# EAGLE design archadehid_revA (EAGLE 6.5.0)

## Sheet 1 of 2
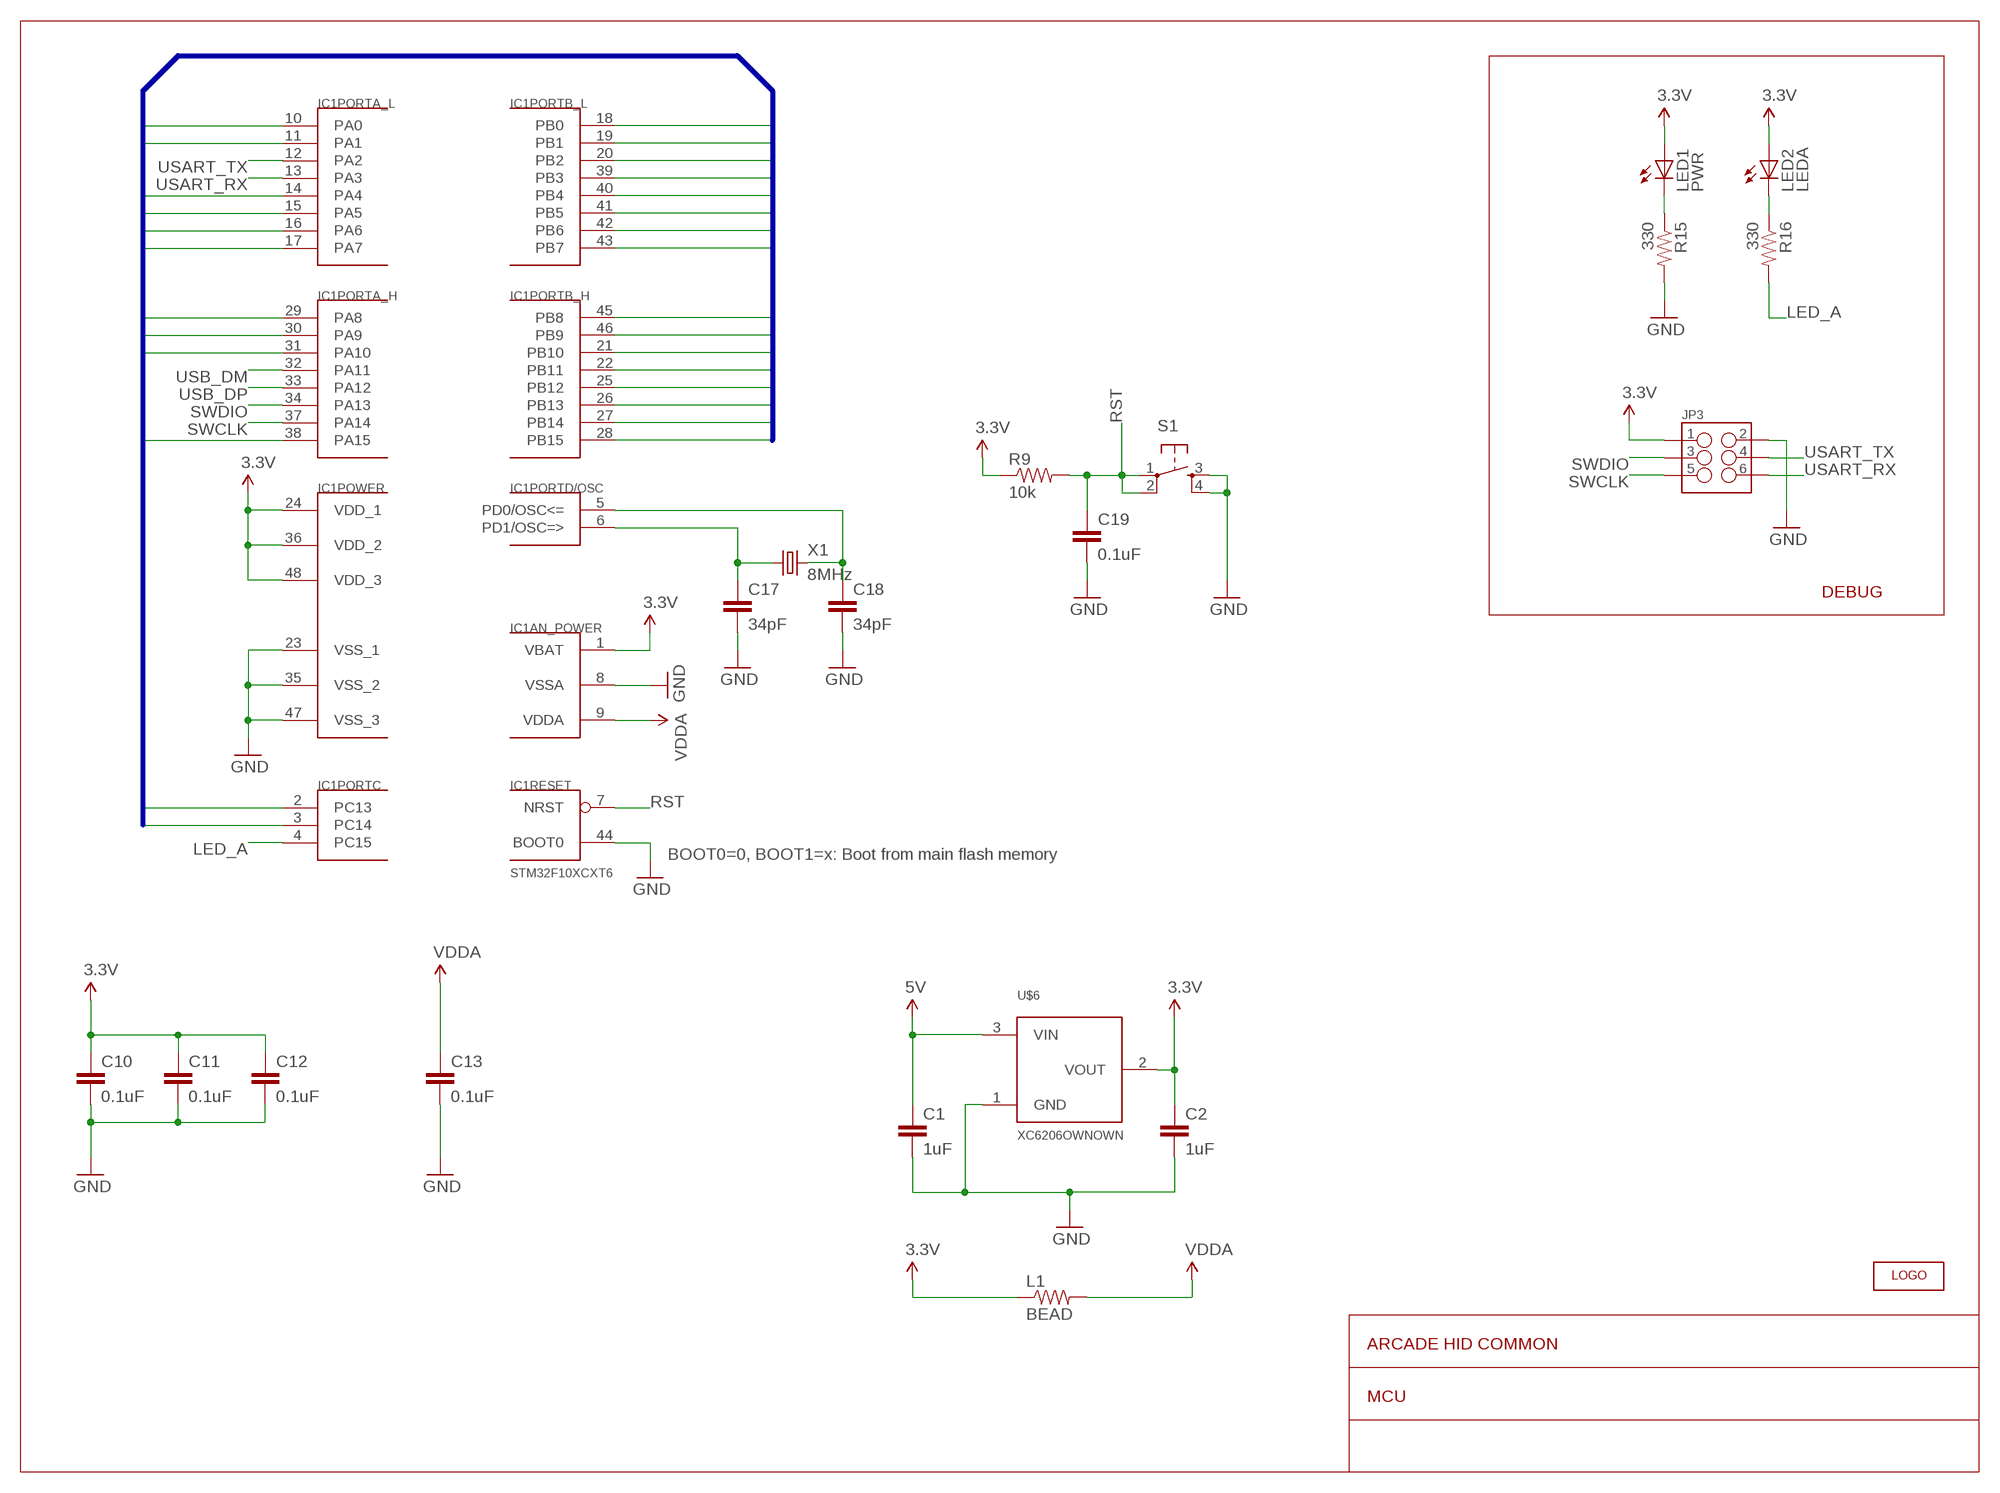
[diagram p0: schematic, sheet 1]

### Parts
C1  1uF  CAP0805  [0805_GEN]
C2  1uF  CAP0805  [0805_GEN]
C10  0.1uF  CAP0402  [C0402]
C11  0.1uF  CAP0402  [C0402]
C12  0.1uF  CAP0402  [C0402]
C13  0.1uF  CAP0402  [C0402]
C17  34pF  CAP0402  [C0402]
C18  34pF  CAP0402  [C0402]
C19  0.1uF  CAP0402  [C0402]
IC1  STM32F10XCXT6  [TQFP48]
JP3  M03X2NO_SILK  [2X3-NS]
L1  BEAD  RESISTOR0603  [0603_GEN]
LED1  PWR  LED0603  [LED-0603]
LED2  LEDA  LED0603  [LED-0603]
R9  10k  RESISTOR0402  [C0402]
R15  330  RESISTOR0402  [C0402]
R16  330  RESISTOR0402  [C0402]
S1  TAC_SWITCHSMD  [TACTILE_SWITCH_SMD]
U$6  XC6206OWNOWN  [SOT23]
U$7  LOGOLOGO  [LOGO]
X1  8MHz  CRYSTALOWN5X3.2_7A  [CRYSTAL_SMD_5X3.2_7A]

### Nets
3.3V: C2.1 C10.1 C11.1 C12.1 IC1.1(AN_POWER:VBAT) IC1.24(POWER:VDD_1) IC1.36(POWER:VDD_2) IC1.48(POWER:VDD_3) JP3.1 L1.1 LED1.A LED2.A R9.1 U$6.2(VOUT) ; also sheet 2
5V: C1.1 U$6.3(VIN) ; also sheet 2
GND: C1.2 C2.2 C10.2 C11.2 C12.2 C13.2 C17.2 C18.2 C19.2 IC1.8(AN_POWER:VSSA) IC1.23(POWER:VSS_1) IC1.35(POWER:VSS_2) IC1.44(RESET:BOOT0) IC1.47(POWER:VSS_3) JP3.2 R15.2 S1.3 S1.4 U$6.1(GND) ; also sheet 2
LED_A: IC1.4(PORTC:PC15) R16.2
N$4: LED1.C R15.1
N$5: LED2.C R16.1
OSCI: C18.1 IC1.5(PORTD/OSC:PD0/OSC<=) X1.P$2
OSCO: C17.1 IC1.6(PORTD/OSC:PD1/OSC=>) X1.P$1
PA0: IC1.10(PORTA_L:PA0) ; also sheet 2
PA1: IC1.11(PORTA_L:PA1) ; also sheet 2
PA4: IC1.14(PORTA_L:PA4) ; also sheet 2
PA5: IC1.15(PORTA_L:PA5) ; also sheet 2
PA6: IC1.16(PORTA_L:PA6) ; also sheet 2
PA7: IC1.17(PORTA_L:PA7) ; also sheet 2
PA8: IC1.29(PORTA_H:PA8) ; also sheet 2
PA9: IC1.30(PORTA_H:PA9) ; also sheet 2
PA10: IC1.31(PORTA_H:PA10) ; also sheet 2
PA15: IC1.38(PORTA_H:PA15) ; also sheet 2
PB0: IC1.18(PORTB_L:PB0) ; also sheet 2
PB1: IC1.19(PORTB_L:PB1) ; also sheet 2
PB2: IC1.20(PORTB_L:PB2) ; also sheet 2
PB3: IC1.39(PORTB_L:PB3) ; also sheet 2
PB4: IC1.40(PORTB_L:PB4) ; also sheet 2
PB5: IC1.41(PORTB_L:PB5) ; also sheet 2
PB6: IC1.42(PORTB_L:PB6) ; also sheet 2
PB7: IC1.43(PORTB_L:PB7) ; also sheet 2
PB8: IC1.45(PORTB_H:PB8) ; also sheet 2
PB9: IC1.46(PORTB_H:PB9) ; also sheet 2
PB10: IC1.21(PORTB_H:PB10) ; also sheet 2
PB11: IC1.22(PORTB_H:PB11) ; also sheet 2
PB12: IC1.25(PORTB_H:PB12) ; also sheet 2
PB13: IC1.26(PORTB_H:PB13) ; also sheet 2
PB14: IC1.27(PORTB_H:PB14) ; also sheet 2
PB15: IC1.28(PORTB_H:PB15) ; also sheet 2
PC13: IC1.2(PORTC:PC13) ; also sheet 2
PC14: IC1.3(PORTC:PC14) ; also sheet 2
RST: C19.1 IC1.7(RESET:NRST) R9.2 S1.1 S1.2
SWCLK: IC1.37(PORTA_H:PA14) JP3.5
SWDIO: IC1.34(PORTA_H:PA13) JP3.3
USART_RX: IC1.13(PORTA_L:PA3) JP3.6
USART_TX: IC1.12(PORTA_L:PA2) JP3.4
USB_DM: IC1.32(PORTA_H:PA11) ; also sheet 2
USB_DP: IC1.33(PORTA_H:PA12) ; also sheet 2
VDDA: C13.1 IC1.9(AN_POWER:VDDA) L1.2

### Buses
PA[0..1],PA[4..10],PA15,PB[0..15],PC[13..14]

### Notes on the sheet
- DEBUG
- BOOT0=0, BOOT1=x: Boot from main flash memory
- ARCADE HID COMMON
- MCU

## Sheet 2 of 2
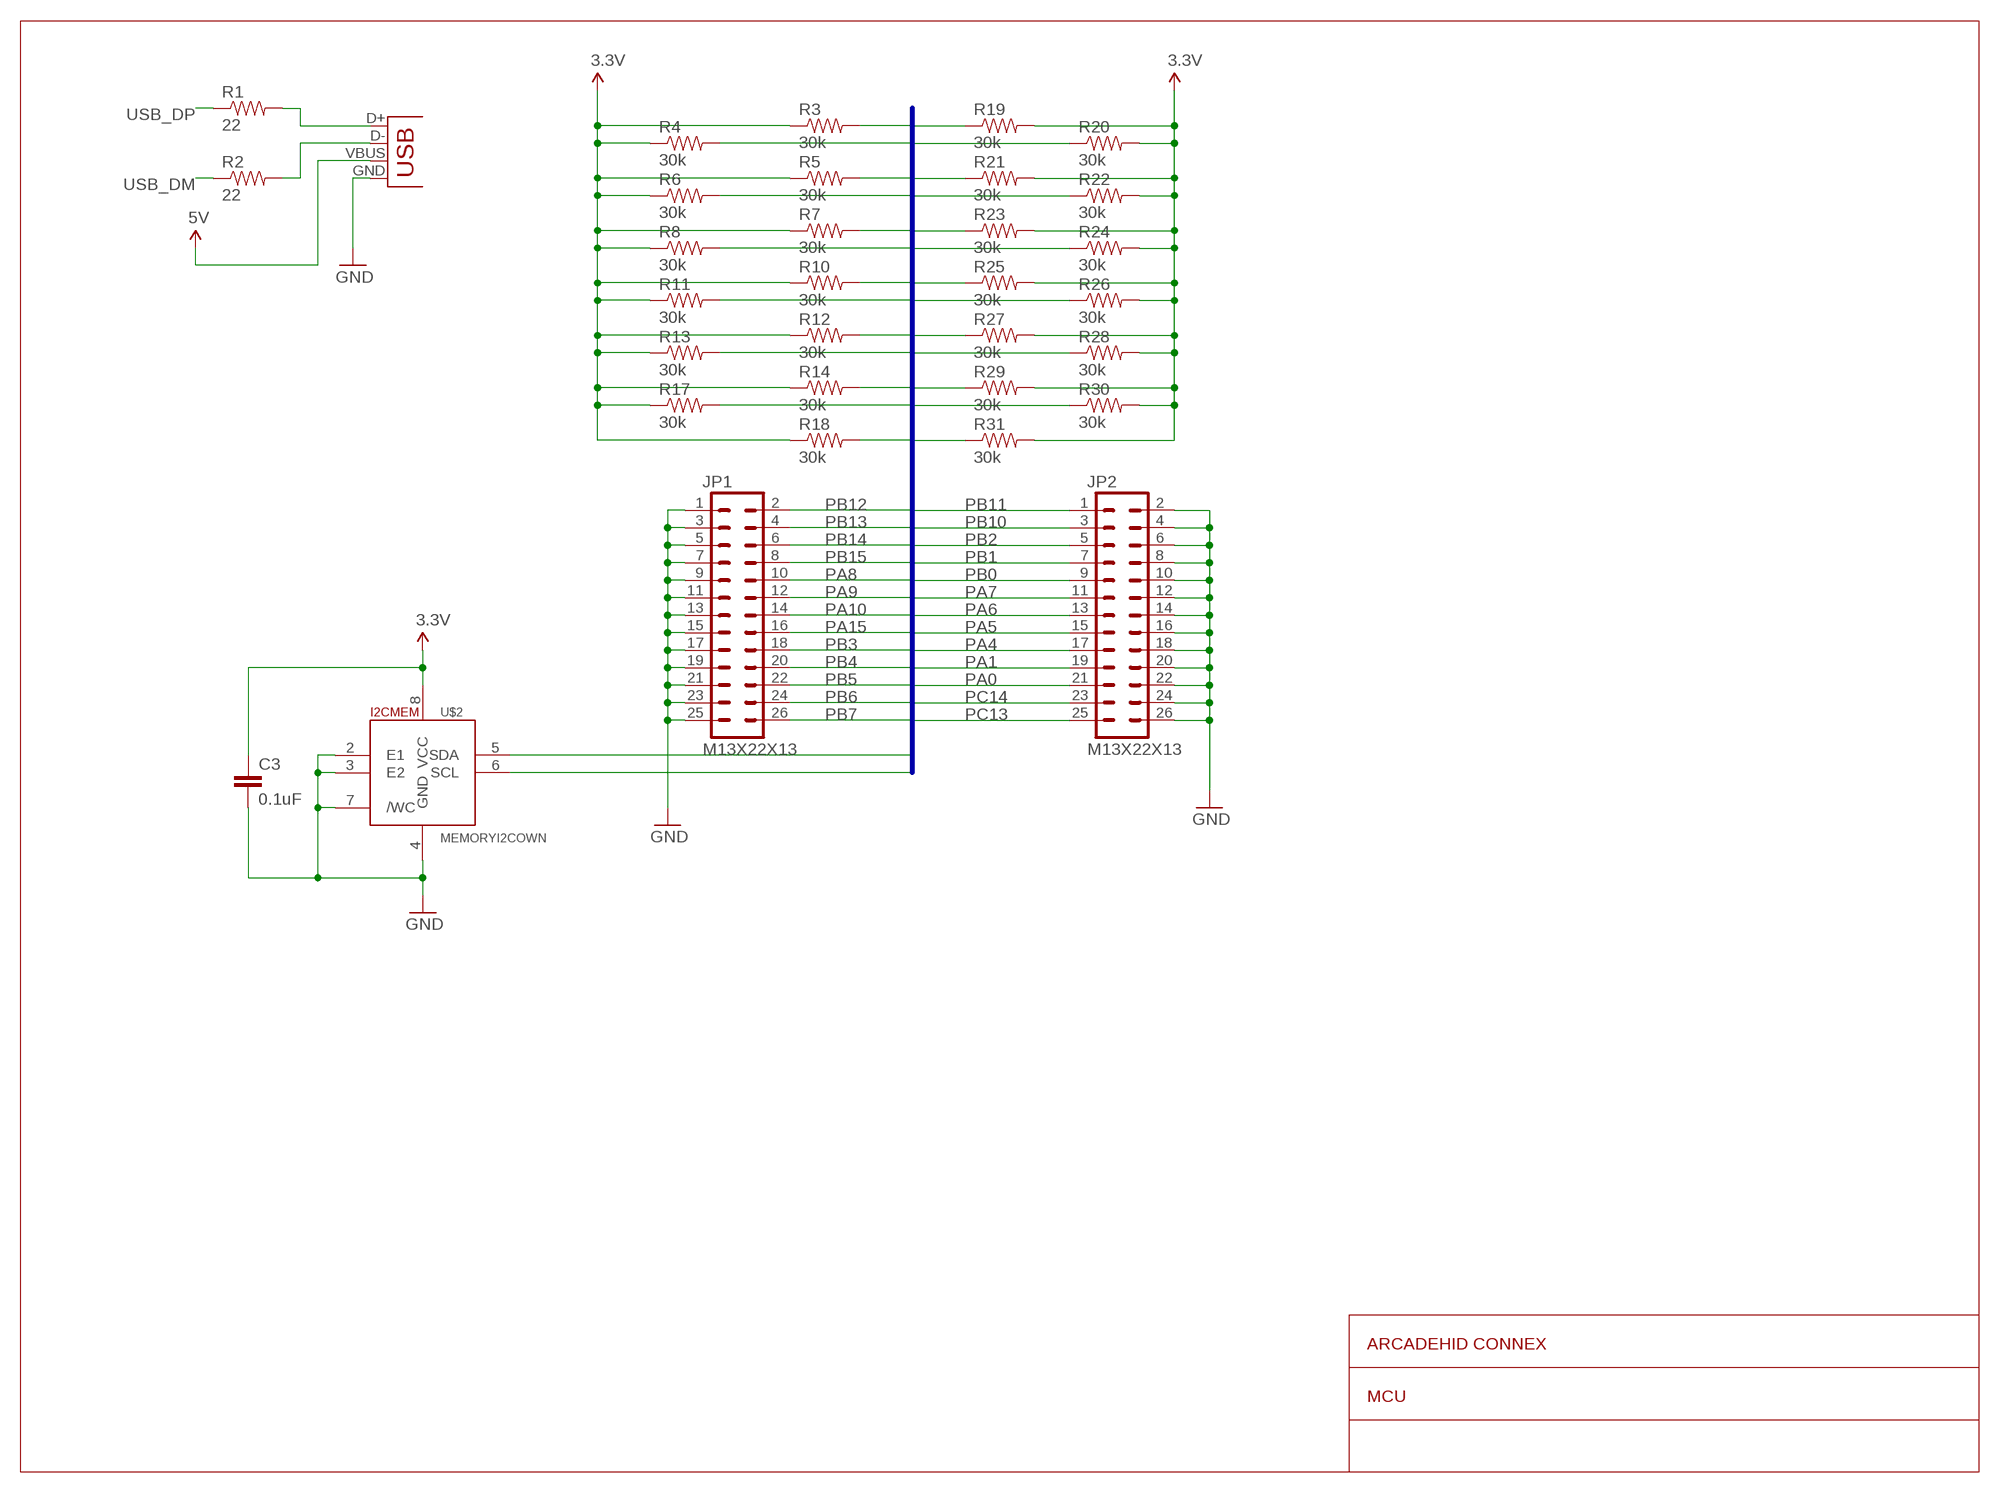
[diagram p1: schematic, sheet 2]

### Parts
C3  0.1uF  CAP0402  [C0402]
JP1  M13X22X13  [2X13]
JP2  M13X22X13  [2X13]
R1  22  RESISTOR0402  [C0402]
R2  22  RESISTOR0402  [C0402]
R3  30k  RESISTOR0402  [C0402]
R4  30k  RESISTOR0402  [C0402]
R5  30k  RESISTOR0402  [C0402]
R6  30k  RESISTOR0402  [C0402]
R7  30k  RESISTOR0402  [C0402]
R8  30k  RESISTOR0402  [C0402]
R10  30k  RESISTOR0402  [C0402]
R11  30k  RESISTOR0402  [C0402]
R12  30k  RESISTOR0402  [C0402]
R13  30k  RESISTOR0402  [C0402]
R14  30k  RESISTOR0402  [C0402]
R17  30k  RESISTOR0402  [C0402]
R18  30k  RESISTOR0402  [C0402]
R19  30k  RESISTOR0402  [C0402]
R20  30k  RESISTOR0402  [C0402]
R21  30k  RESISTOR0402  [C0402]
R22  30k  RESISTOR0402  [C0402]
R23  30k  RESISTOR0402  [C0402]
R24  30k  RESISTOR0402  [C0402]
R25  30k  RESISTOR0402  [C0402]
R26  30k  RESISTOR0402  [C0402]
R27  30k  RESISTOR0402  [C0402]
R28  30k  RESISTOR0402  [C0402]
R29  30k  RESISTOR0402  [C0402]
R30  30k  RESISTOR0402  [C0402]
R31  30k  RESISTOR0402  [C0402]
U$2  MEMORYI2COWN  [SO-8]
X3  USB-MINIB  [USB-MINIB]

### Nets
3.3V: C3.1 R3.1 R4.1 R5.1 R6.1 R7.1 R8.1 R10.1 R11.1 R12.1 R13.1 R14.1 R17.1 R18.1 R19.2 R20.2 R21.2 R22.2 R23.2 R24.2 R25.2 R26.2 R27.2 R28.2 R29.2 R30.2 R31.2 U$2.8(VCC) ; also sheet 1
5V: X3.VBUS ; also sheet 1
GND: C3.2 JP1.1 JP1.3 JP1.5 JP1.7 JP1.9 JP1.11 JP1.13 JP1.15 JP1.17 JP1.19 JP1.21 JP1.23 JP1.25 JP2.2 JP2.4 JP2.6 JP2.8 JP2.10 JP2.12 JP2.14 JP2.16 JP2.18 JP2.20 JP2.22 JP2.24 JP2.26 U$2.2(E1) U$2.3(E2) U$2.4(GND) U$2.7(/WC) X3.GND ; also sheet 1
N$1: R1.2 X3.D+
N$2: R2.2 X3.D-
PA0: JP2.21 R29.1 ; also sheet 1
PA1: JP2.19 R28.1 ; also sheet 1
PA4: JP2.17 R27.1 ; also sheet 1
PA5: JP2.15 R26.1 ; also sheet 1
PA6: JP2.13 R25.1 ; also sheet 1
PA7: JP2.11 R24.1 ; also sheet 1
PA8: JP1.10 R7.2 ; also sheet 1
PA9: JP1.12 R8.2 ; also sheet 1
PA10: JP1.14 R10.2 ; also sheet 1
PA15: JP1.16 R11.2 ; also sheet 1
PB0: JP2.9 R23.1 ; also sheet 1
PB1: JP2.7 R22.1 ; also sheet 1
PB2: JP2.5 R21.1 ; also sheet 1
PB3: JP1.18 R12.2 ; also sheet 1
PB4: JP1.20 R13.2 ; also sheet 1
PB5: JP1.22 R14.2 ; also sheet 1
PB6: JP1.24 R17.2 ; also sheet 1
PB7: JP1.26 R18.2 ; also sheet 1
PB8: U$2.6(SCL) ; also sheet 1
PB9: U$2.5(SDA) ; also sheet 1
PB10: JP2.3 R20.1 ; also sheet 1
PB11: JP2.1 R19.1 ; also sheet 1
PB12: JP1.2 R3.2 ; also sheet 1
PB13: JP1.4 R4.2 ; also sheet 1
PB14: JP1.6 R5.2 ; also sheet 1
PB15: JP1.8 R6.2 ; also sheet 1
PC13: JP2.25 R31.1 ; also sheet 1
PC14: JP2.23 R30.1 ; also sheet 1
USB_DM: R2.1 ; also sheet 1
USB_DP: R1.1 ; also sheet 1

### Buses
PA[0..1],PA[4..10],PA15,PB[0..15],PC[13..14]

### Notes on the sheet
- ARCADEHID CONNEX
- MCU

## Library data of the parts
C1-C3 C10-C13 C17-C19 = robot:CAP: Capacitor Standard 0603 ceramic capacitor, and 0.1" leaded capacitor.
IC1 = stm32:STM32F10XCXT6: ST STM32F101/103 48pin LQFP
JP1 JP2 = SparkFun-Connectors:M13X2: 0.1" spaced headers
JP3 = SparkFun-Connectors:M03X2: 2x3 .1" header. Shrouded, with keying- CONN-10681 SMT- CONN-11415 Pogo pins- HW-11044
L1 = robot:RESISTOR: Resistor Basic schematic elements and footprints for 0603, 1206, and PTH 1/10th watt (small) resistors.
LED1 LED2 = SparkFunEagle-6-6-07:LED: LEDs Standard schematic elements and footprints for 5mm, 3mm, 1206, and 0603 sized LEDs. 5mm - Spark Fun Electronics SKU : COM-00529 (and others)
R1-R31 = SparkFunEagle-6-6-07:RESISTOR: Resistor Basic schematic elements and footprints for 0603, 1206, and PTH 1/10th watt (small) resistors.
S1 = SparkFun-Electromechanical:TAC_SWITCH: Momentary Switch Button commonly used for reset or general input. Spark Fun Electronics SKU : COM-00097 SMT- SWCH-08247; PROD_ID: SWCH-08247
U$2 = robot:MEMORYI2C
U$6 = robot:XC6206
U$7 = robot:LOGO
X1 = robot:CRYSTAL: Crystals Various standard crystals. Proven footprints. Spark Fun Electronics SKU : COM-00534
X3 = robot:USB: USB Connectors USB-B-PTH is fully proven SKU : PRT-00139 USB-miniB is fully proven SKU : PRT-00587 USB-A-H is throughly reviewed, but untested. Spark Fun Electronics SKU : PRT-00437 USB-B-SMT is throughly reviewed, but untested. Needs silkscreen touching up. USB-A-S has not been used/tested USB-MB-H has not been used/tested

## Board
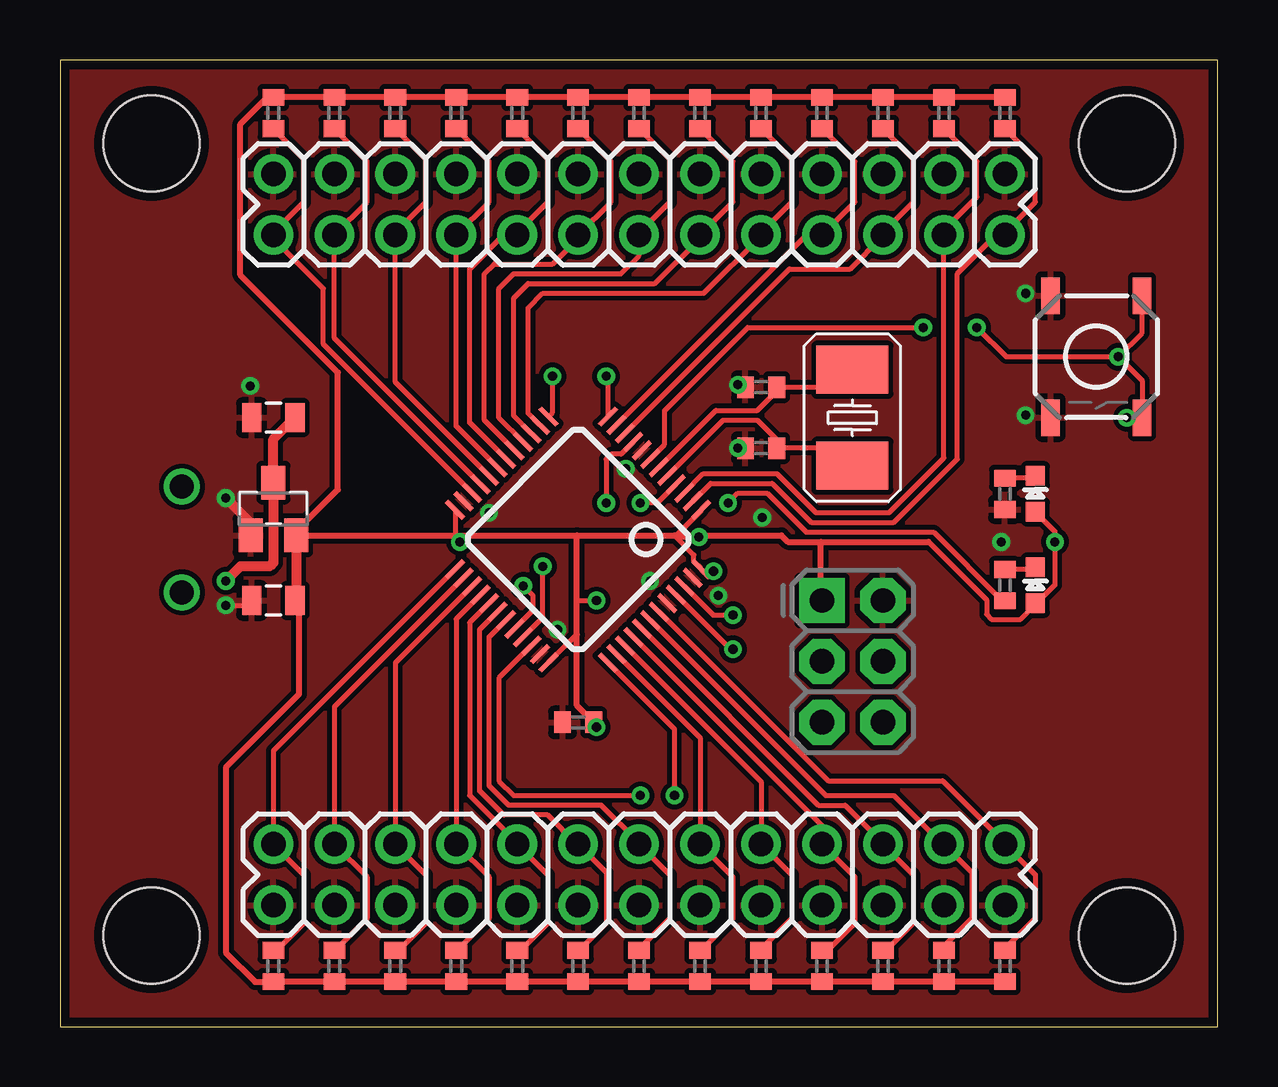
[diagram p2: board, top side]
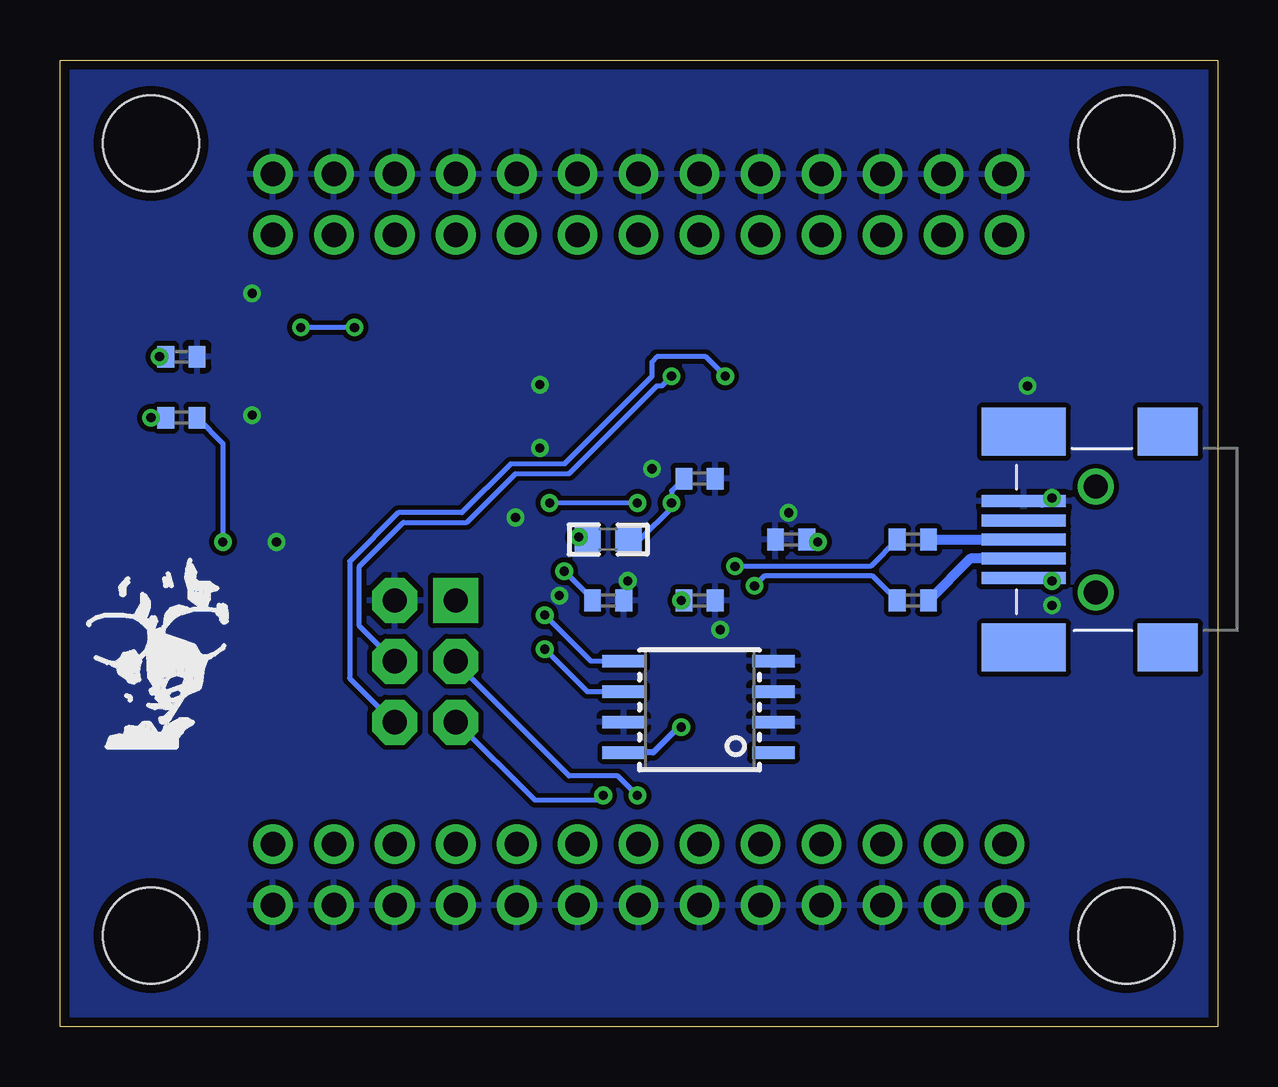
[diagram p3: board, bottom side, seen from below]

Size 48.24 x 40.31 mm. Coordinates in mm from the lower left corner, seen from the top.
Outline: 0,0 48.24,0 48.24,40.31 0,40.31 0,0
Copper layers (1*16): Top 0.0356mm / dielectric 1.5011mm / Bottom 0.0356mm
Design rules "LaenPCBOrder *": minimum track width 6mil, minimum drill 13mil, track to track 6mil, track to pad 6mil, pad to pad 6mil, via to via 6mil, smd to smd 6mil, copper to edge 15mil, drill to drill 6mil, minimum pad ring 7mil, minimum via ring 7mil, stop-mask expansion 3mil, vias tented up to drill 15mil, thermal gap 10mil
Holes 4 mm at 3.81,36.83 44.45,3.81 44.45,36.83 3.81,3.81

### Footprints (pad centres in the part's own frame; a part is rotated, then mirrored left to right if it is on the bottom)
0805_GEN = smd 0.8 x 1.2: 1 -0.9,0; 2 0.9,0
C0402 = smd 0.7 x 0.9: 1 -0.65,0; 2 0.65,0
TQFP48 = smd 0.2 x 1: 1 -2.75,-4.5; 2 -2.25,-4.5; 3 -1.75,-4.5; 4 -1.25,-4.5; 5 -0.75,-4.5; 6 -0.25,-4.5; 7 0.25,-4.5; 8 0.75,-4.5; 9 1.25,-4.5; 10 1.75,-4.5; 11 2.25,-4.5; 12 2.75,-4.5; 25 2.75,4.5; 26 2.25,4.5; 27 1.75,4.5; 28 1.25,4.5; 29 0.75,4.5; 30 0.25,4.5; 31 -0.25,4.5; 32 -0.75,4.5; 33 -1.25,4.5; 34 -1.75,4.5; 35 -2.25,4.5; 36 -2.75,4.5 | smd 1 x 0.2: 13 4.5,-2.75; 14 4.5,-2.25; 15 4.5,-1.75; 16 4.5,-1.25; 17 4.5,-0.75; 18 4.5,-0.25; 19 4.5,0.25; 20 4.5,0.75; 21 4.5,1.25; 22 4.5,1.75; 23 4.5,2.25; 24 4.5,2.75; 37 -4.5,2.75; 38 -4.5,2.25; 39 -4.5,1.75; 40 -4.5,1.25; 41 -4.5,0.75; 42 -4.5,0.25; 43 -4.5,-0.25; 44 -4.5,-0.75; 45 -4.5,-1.25; 46 -4.5,-1.75; 47 -4.5,-2.25; 48 -4.5,-2.75
2X13 = drill 1.016 pad 1.651: 1 0,0; 2 0,2.54; 3 2.54,0; 4 2.54,2.54; 5 5.08,0; 6 5.08,2.54; 7 7.62,0; 8 7.62,2.54; 9 10.16,0; 10 10.16,2.54; 11 12.7,0; 12 12.7,2.54; 13 15.24,0; 14 15.24,2.54; 15 17.78,0; 16 17.78,2.54; 17 20.32,0; 18 20.32,2.54; 19 22.86,0; 20 22.86,2.54; 21 25.4,0; 22 25.4,2.54; 23 27.94,0; 24 27.94,2.54; 25 30.48,0; 26 30.48,2.54
2X3-NS = drill 1.016 pad 1.88 square: 1 -2.54,-1.27 | drill 1.016 pad 1.88 octagon: 2 -2.54,1.27; 3 0,-1.27; 4 0,1.27; 5 2.54,-1.27; 6 2.54,1.27
0603_GEN = smd 1.1 x 1: 1 -0.85,0; 2 0.85,0
LED-0603 = smd 0.8 x 0.8: A 0,-0.75; C 0,0.75
TACTILE_SWITCH_SMD = smd 1.524 x 0.762: 1 -2.54,1.905; 2 2.54,1.905; 3 -2.54,-1.905; 4 2.54,-1.905
SO-8 = smd 1.778 x 0.508: 1 -3.08,1.262; 2 -3.08,-0.008; 3 -3.08,-1.278; 4 -3.08,-2.548; 5 3.159,-2.548; 6 3.159,-1.278; 7 3.159,-0.008; 8 3.159,1.262
SOT23 = smd 1 x 1.4: 1 -0.95,-1.1; 2 0.95,-1.1; 3 0,1.1
CRYSTAL_SMD_5X3.2_7A = smd 2 x 3: P$1 -2,0; P$2 2,0
USB-MINIB = smd 2.5 x 2: 1 -3,-4.5; 2 -3,4.5 | smd 3.5 x 2: 3 3,-4.5; 4 3,4.5 | smd 3.5 x 0.5: D+ 3,0; D- 3,0.8; GND 3,-1.6; ID 3,-0.8; VBUS 3.01,1.61 | drill 1 pad 1.27: P$1 0,2.2; P$2 0,-2.2

### Placement (x,y rotation side)
C1  8.89,25.4 180 top
C2  8.89,17.78 180 top
C3  21.59,12.7 180 top
C10  17.78,20.32 180 bottom
C11  25.4,17.78 0 bottom
C12  21.59,17.78 0 bottom
C13  21.59,22.86 0 bottom
C17  29.21,26.67 180 top
C18  29.21,24.13 180 top
C19  43.18,27.94 0 bottom
IC1  21.59,20.32 135 top
JP1  8.89,5.08 0 top
JP2  8.89,33.02 0 top
JP3  33.02,15.24 270 top
L1  25.4,20.32 0 bottom
LED1  40.64,22.22 0 top
LED2  40.64,18.41 0 top
R1  12.7,20.32 0 bottom
R2  12.7,17.78 0 bottom
R3  8.89,2.54 90 top
R4  11.43,2.54 90 top
R5  13.97,2.54 90 top
R6  16.51,2.54 90 top
R7  19.05,2.54 90 top
R8  21.59,2.54 90 top
R9  43.18,25.4 180 bottom
R10  24.13,2.54 90 top
R11  26.67,2.54 90 top
R12  29.21,2.54 90 top
R13  31.75,2.54 90 top
R14  34.29,2.54 90 top
R15  39.37,22.22 270 top
R16  39.37,18.41 270 top
R17  36.83,2.54 90 top
R18  39.37,2.54 90 top
R19  8.89,38.1 90 top
R20  11.43,38.1 90 top
R21  13.97,38.1 90 top
R22  16.51,38.1 90 top
R23  19.05,38.1 90 top
R24  21.59,38.1 90 top
R25  24.13,38.1 90 top
R26  26.67,38.1 90 top
R27  29.21,38.1 90 top
R28  31.75,38.1 90 top
R29  34.29,38.1 90 top
R30  36.83,38.1 90 top
R31  39.37,38.1 90 top
S1  43.18,27.94 270 top
U$2  21.59,12.7 180 bottom
U$6  8.89,21.59 0 top
U$7  44.04,16 0 bottom
X1  33.02,25.4 270 top
X3  5.08,20.32 180 bottom

### Tracks (layer width: path | path; a pad name or v marks a point on that pad's centre or on a via)
3.3V  (via drill 0.38 pad 0.25)
  Top 0.203: 21.54,16.36 21.11,15.95 IC1.36 | 25.67,20.42 26.42,19.68 26.42,19.41 26.72,19.11 IC1.48 26.84,19 v27.23,19 | 25.64,20.46 25.6,20.49 | IC1.1 26.72,21.54 25.64,20.46 | IC1.24 16.46,20.49 | 16.46,20.49 | 21.54,17.78 v22.35,17.78 | 25.64,20.46 25.67,20.42 | 25.67,20.42 v26.62,20.42 | 16.46,20.49 16.66,20.29 v16.66,20.22 | 36.2,20.22 38.61,17.8 38.61,17.2 38.81,16.99 40.03,16.99 40.64,17.6 LED2.A 40.7,17.66 41.45,18.41 v41.45,20.22 41.45,20.66 LED1.A | C3.1 22.35,12.59 v22.35,12.5 | U$6.2 9.83,20.65
  Top 0.254: U$6.2 16.46,20.49 21.54,20.49 | 21.54,20.49 25.6,20.49 30.06,20.49 30.33,20.22 31.7,20.22 | 21.54,20.49 21.54,17.78 21.54,16.36 21.54,13.4 C3.1 | 31.7,20.22 36.2,20.22 | JP3.1 31.7,17.83 31.7,20.22 | R18.1 R17.1 R14.1 R13.1 R12.1 R11.1 R10.1 R8.1 R7.1 R6.1 R5.1 R4.1 R3.1 8.75,1.89 8.74,1.88 8.13,1.88 6.91,3.1 6.91,10.82 9.96,13.87 9.96,17.32 9.79,17.49 C2.1 | R31.2 R30.2 R29.2 R28.2 R27.2 R26.2 R25.2 R24.2 R23.2 R22.2 R21.2 R20.2 R19.2 8.63,38.75 7.52,37.64 7.52,31.34 11.58,27.28 11.58,22.4 9.83,20.65 9.75,20.57
  Top 0.406: U$6.2 9.84,17.83 C2.1
  Bottom 0.203: v22.35,17.78 C12.1 | v26.62,20.42 26.52,20.32 L1.1 | v27.23,19 26.05,17.82 C11.1 | C10.1 17.07,20.38 17.07,20.49 16.8,20.22 v16.66,20.22 | 22.47,12.5 v22.35,12.5 | R9.1 41.45,24.32 v41.45,20.22
  Bottom 0.254: U$2.8 23.53,11.44 22.47,12.5
5V  (via drill 0.38 pad 0.25)
  Top 0.406: v6.91,18.59 7.52,19.2 8.74,19.2 8.89,19.36 U$6.3 8.89,24.5 C1.1
  Bottom 0.406: 6.71,18.59 v6.91,18.59 7.03,18.71 X3.VBUS
GND  (via drill 0.38 pad 0.25)
  Top 0.203: v6.91,17.58 7.79,17.58 C2.2
  Top 0.406: U$6.1 7.94,21.02 v6.91,22.05
  Bottom 0.406: v6.91,22.05 7.32,21.84 X3.GND
  other vias: 28.24,24.13 28.24,26.77 7.92,26.72 24.59,18.59 27.43,17.98 20.73,16.56 17.88,21.44 23.57,23.27 29.26,21.23 40.23,30.58 40.23,25.5 39.22,20.22
  pour Bottom (isolate 0.203): 0,40.23 48.21,40.23 48.21,0 0,0
  pour Top (isolate 0.203): 0,40.23 48.21,40.23 48.21,0 0,0
LED_A  (via drill 0.38 pad 0.25)
  Top 0.203: IC1.4 24.88,21.84 v24.18,21.84 | v27.84,21.84 28.25,22.25 29.46,22.25 31.09,20.62 36.4,20.62 39.26,17.77 R16.2
  Bottom 0.203: v24.18,21.84 v27.84,21.84
N$1
  Bottom 0.406: R1.2 X3.D+
N$2
  Bottom 0.406: X3.D- 10.31,19.52 R2.2
N$4
  Top 0.203: LED1.C 40.54,22.88 R15.1
N$5
  Top 0.203: LED2.C 40.54,19.07 R16.1
OSCI
  Top 0.203: 32.29,24.13 C18.1 29.86,24.5 29.06,25.3 27.63,25.3 IC1.5
  Top 0.254: 32.29,24.13 X1.P$2
OSCO
  Top 0.203: C17.1 32.29,26.67 | C17.1 29.86,26.56 | IC1.6 27.33,25.7 29.06,25.7 29.86,26.51 C17.1
  Top 0.254: 32.29,26.67 X1.P$1
PA0
  Top 0.203: IC1.10 30.39,31.6 32.92,31.6 34.29,32.97 JP2.21 34.29,33.12 35.56,34.39 35.56,36.18 R29.1
PA1
  Top 0.203: IC1.11 31.11,33.02 JP2.19 33.12,34.39 33.12,36.08 R28.1
PA4
  Top 0.203: IC1.14 19.51,25.59 19.51,29.97 20.12,30.58 26.82,30.58 29.21,32.97 JP2.17 29.21,33.12 30.48,34.39 30.48,36.18 R27.1
PA5
  Top 0.203: IC1.15 18.9,25.49 18.9,30.38 19.51,30.99 24.79,30.99 26.67,32.87 JP2.15 28.04,34.39 28.04,36.08 R26.1
PA6
  Top 0.203: IC1.16 18.29,25.39 18.29,30.79 18.9,31.39 23.37,31.39 24.13,32.16 JP2.13 24.13,33.12 25.4,34.39 25.4,36.18 R25.1
PA7
  Top 0.203: IC1.17 17.68,25.29 17.68,31.39 18.09,31.8 20.52,31.8 21.59,32.87 JP2.11 22.96,34.39 22.96,36.08 R24.1
PA8
  Top 0.203: IC1.29 17.07,16.86 17.07,9.65 19.05,7.67 JP1.10 20.32,6.35 20.32,4.32 19.19,3.19 R7.2
PA9
  Top 0.203: IC1.30 17.48,16.56 17.48,9.86 18.49,8.84 20.32,8.84 21.54,7.62 JP1.12 22.76,6.45 22.76,4.32 21.63,3.19 R8.2
PA10
  Top 0.203: IC1.31 17.88,16.26 17.88,10.06 18.69,9.25 22.55,9.25 24.13,7.67 JP1.14 25.4,6.35 25.4,4.52 24.13,3.25 R10.2
PA15
  Top 0.203: IC1.38 26.67,12.06 JP1.16 28.04,6.25 28.04,4.52 26.71,3.19 R11.2
PB0
  Top 0.203: IC1.18 17.07,25.2 17.07,31.6 18.49,33.02 JP2.9 19.05,33.12 20.32,34.39 20.32,36.18 R23.1
PB1
  Top 0.203: IC1.19 16.51,25.05 JP2.7 17.88,34.39 17.88,36.08 R22.1
PB2
  Top 0.203: IC1.20 13.97,26.88 JP2.5 13.97,33.12 15.24,34.39 15.24,36.18 R21.1
PB3
  Top 0.203: IC1.39 29.21,10.22 JP1.18 30.48,6.35 30.48,4.52 29.21,3.25 R12.2
PB4
  Top 0.203: IC1.40 31.75,8.39 JP1.20 33.12,6.25 33.12,4.32 31.99,3.19 R13.2
PB5
  Top 0.203: IC1.41 31.6,9.25 32.72,9.25 34.29,7.67 JP1.22 35.56,6.35 35.56,4.32 34.43,3.19 R14.2
PB6
  Top 0.203: IC1.42 31.9,9.65 34.75,9.65 36.78,7.62 JP1.24 38,6.45 38,4.52 36.83,3.35 R17.2
PB7
  Top 0.203: IC1.43 32,10.26 36.78,10.26 39.37,7.67 JP1.26 40.64,6.35 40.64,4.52 39.37,3.25 R18.2
PB8  (via drill 0.38 pad 0.25)
  Top 0.203: IC1.45 27.93,15.75 v28.04,15.75
  Bottom 0.203: v28.04,15.75 26.27,13.98 U$2.6
PB9  (via drill 0.38 pad 0.25)
  Top 0.203: IC1.46 27.21,17.17 v28.04,17.17
  Bottom 0.203: v28.04,17.17 26.12,15.25 U$2.5
PB10
  Top 0.203: IC1.21 11.43,28.71 JP2.3 12.8,34.39 12.8,36.08 R20.1
PB11
  Top 0.203: IC1.22 10.97,28.46 10.97,30.79 8.89,32.87 JP2.1 8.89,33.12 10.16,34.39 10.16,36.18 R19.1
PB12
  Top 0.203: IC1.25 8.89,11.51 JP1.2 10.16,6.35 10.16,4.32 9.03,3.19 R3.2
PB13
  Top 0.203: IC1.26 11.43,13.34 JP1.4 12.8,6.25 12.8,4.52 11.47,3.19 R4.2
PB14
  Top 0.203: IC1.27 13.97,15.17 JP1.6 15.24,6.35 15.24,4.32 14.11,3.19 R5.2
PB15
  Top 0.203: IC1.28 16.51,17.01 JP1.8 17.88,6.25 17.88,4.52 16.55,3.19 R6.2
PC13
  Top 0.203: IC1.2 27.11,22.66 29.67,22.66 31.29,21.03 34.75,21.03 37.39,23.67 37.39,31.39 39.01,33.02 JP2.25 39.37,33.12 40.64,34.39 40.64,36.18 R31.1
PC14
  Top 0.203: IC1.3 26.81,23.06 29.87,23.06 31.5,21.44 34.54,21.44 36.83,23.72 JP2.23 36.83,33.22 38.2,34.6 38.2,36.08 R30.1
RST  (via drill 0.38 pad 0.25)
  Top 0.203: IC1.7 25.2,24.28 25.2,25.7 28.65,29.16 v35.97,29.16 | v38.2,29.16 39.42,27.94 v44.09,27.94 | S1.1 45.09,28.93 v44.09,27.94 | v44.09,27.94 45.09,26.95 S1.2 v44.45,25.4
  Bottom 0.203: v35.97,29.16 v38.2,29.16 | v44.09,27.94 C19.1 | v44.45,25.4 R9.2
SWCLK  (via drill 0.38 pad 0.25)
  Top 0.203: IC1.37 25.6,12.42 v25.6,9.65
  Bottom 0.203: v25.6,9.65 25.81,9.45 28.45,9.45 31.7,12.7 JP3.5
SWDIO  (via drill 0.38 pad 0.25)
  Top 0.203: IC1.34 18.29,14.54 18.29,10.26 18.9,9.65 v24.18,9.65
  Bottom 0.203: v24.18,9.65 24.99,10.46 27.03,10.46 31.75,15.19 JP3.3
USART_RX  (via drill 0.38 pad 0.25)
  Top 0.203: IC1.13 20.52,25.62 v20.52,27.13
  Bottom 0.203: v20.52,27.13 21.34,27.94 23.37,27.94 23.57,27.74 23.57,27.13 27.23,23.47 29.46,23.47 31.5,21.44 34.14,21.44 36.17,19.41 36.17,14.53 34.34,12.7 JP3.6
USART_TX  (via drill 0.38 pad 0.25)
  Top 0.203: v22.76,27.13 22.83,27.06 IC1.12
  Bottom 0.203: JP3.4 35.76,16.71 35.76,19.2 33.93,21.03 31.29,21.03 29.26,23.06 27.03,23.06 23.37,26.72 23.16,26.72 v22.76,27.13
USB_DM  (via drill 0.38 pad 0.25)
  Top 0.203: v19.3,18.39 19.71,17.98 19.71,17.38 IC1.32
  Bottom 0.203: R2.1 14.37,18.8 18.9,18.8 v19.3,18.39
USB_DP  (via drill 0.38 pad 0.25)
  Top 0.203: IC1.33 20.12,17.08 v20.12,19.2
  Bottom 0.203: R1.1 14.47,19.2 v20.12,19.2
VDDA  (via drill 0.38 pad 0.25)
  Top 0.203: IC1.9 23.38,23.88 22.96,23.88 22.76,23.67 v22.76,21.84
  Bottom 0.203: L1.2 24.08,20.32 22.76,21.64 v22.76,21.84 22.76,22.34 C13.1

### Text on the board
_tsilk: rev A | 14 | 15 | 16 | 17 | 18 | 19 | 20 | 21 | 22 | 23 | 24 | 25 | 26 | RESET | 8 MHz | PWR | STAT | 3.3V | GND | ARCADEHID | IO | TX | DEBUG | CLK | RX | 7 | 1 | 2 | 3 | 4 | 5 | 6 | 8 | 9 | 10 | 11 | 12 | 13 | www.pelleplutt.com